# Altium project uz_d_iepe.PrjPCB (part 1 of 3)
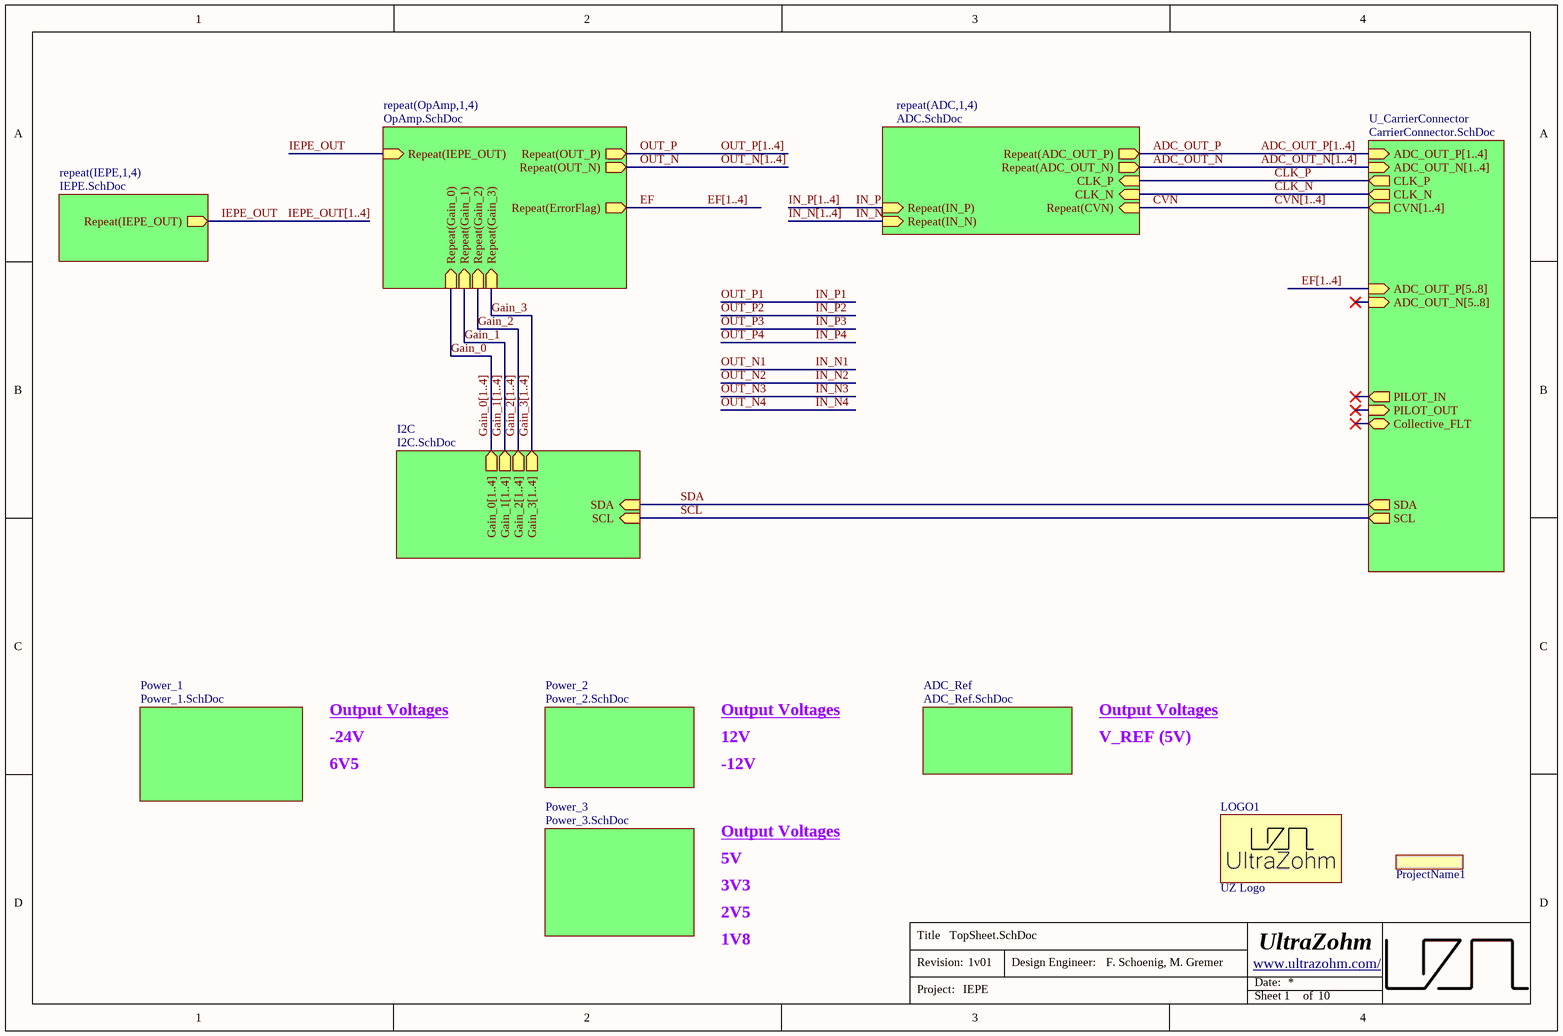
[diagram p0: TopSheet.SchDoc]
Author: F. Schoenig, M. Gremer; AuthorParam: F. Schoenig, M. Gremer; Date: 24.08.2021; ProjectName: IEPE; ProjectRevision: 1v01; SerialNr: 1; website: www.ultrazohm.com/
10 sheets, 404 parts. Net scope: hierarchical (ports join the sheet entries above them; power ports are global).
Board file: uz_d_iepe.PcbDoc
Sheets:
  TopSheet.SchDoc
    U_CarrierConnector = CarrierConnector.SchDoc
    OpAmp1 = OpAmp.SchDoc
    OpAmp2 = OpAmp.SchDoc
    OpAmp3 = OpAmp.SchDoc
    OpAmp4 = OpAmp.SchDoc
    ADC1 = ADC.SchDoc
    ADC2 = ADC.SchDoc
    ADC3 = ADC.SchDoc
    ADC4 = ADC.SchDoc
    Power_2 = Power_2.SchDoc
    Power_3 = Power_3.SchDoc
    ADC_Ref = ADC_Ref.SchDoc
    I2C = I2C.SchDoc
    Power_1 = Power_1.SchDoc
    IEPE1 = IEPE.SchDoc
    IEPE2 = IEPE.SchDoc
    IEPE3 = IEPE.SchDoc
    IEPE4 = IEPE.SchDoc

## Sheet TopSheet.SchDoc: UltraZohm IEPE
size A4; Author: Thomas Kreppel; CompanyName: TH Nürnberg; Organization: UltraZohm; Address1: Kesslerplatz 12; Address2: 90489 Nürnberg; Address3: GERMANY; Revision: 1v01; SheetNumber: 1; SheetTotal: 10; CompanyName2: Institut ELSYS

### Parts
LOGO1  UZ Logo  [UZ_Logo_tiny]  (no BOM)
ProjectName1  Project Name, Rev  [ID_ProjectRev]  (value not drawn)  (no BOM)

### Sub-sheets
ADC_Ref = ADC_Ref.SchDoc: no entries
I2C = I2C.SchDoc: SDA (in), SCL (in), Gain_1[1..4] (out), Gain_0[1..4] (out), Gain_3[1..4] (out), Gain_2[1..4] (out)
Power_1 = Power_1.SchDoc: no entries
Power_2 = Power_2.SchDoc: no entries
Power_3 = Power_3.SchDoc: no entries
repeat(ADC,1,4) = ADC.SchDoc: CLK_P (in), CLK_N (in), Repeat(ADC_OUT_N) (out), Repeat(ADC_OUT_P) (out), Repeat(CVN) (in), Repeat(IN_P) (in), Repeat(IN_N) (in)
repeat(IEPE,1,4) = IEPE.SchDoc: Repeat(IEPE_OUT) (out)
repeat(OpAmp,1,4) = OpAmp.SchDoc: Repeat(IEPE_OUT) (in), Repeat(OUT_P) (out), Repeat(OUT_N) (out), Repeat(Gain_1) (in), Repeat(Gain_3) (in), Repeat(Gain_0) (in), Repeat(Gain_2) (in), Repeat(ErrorFlag) (out)
U_CarrierConnector = CarrierConnector.SchDoc: PILOT_OUT (in), PILOT_IN (out), Collective_FLT (bidir), CLK_P (out), CLK_N (out), ADC_OUT_P[5..8] (in), ADC_OUT_N[5..8] (in), ADC_OUT_P[1..4] (in), ADC_OUT_N[1..4] (in), CVN[1..4] (out), SDA (out), SCL (out)

### Nets
ADC_OUT_N: sheet repeat(ADC,1,4)/Repeat(ADC_OUT_N)
ADC_OUT_P: sheet repeat(ADC,1,4)/Repeat(ADC_OUT_P)
CLK_N: sheet U_CarrierConnector/CLK_N, sheet repeat(ADC,1,4)/CLK_N
CLK_P: sheet U_CarrierConnector/CLK_P, sheet repeat(ADC,1,4)/CLK_P
CVN: sheet repeat(ADC,1,4)/Repeat(CVN)
EF: sheet repeat(OpAmp,1,4)/Repeat(ErrorFlag)
Gain_0: sheet repeat(OpAmp,1,4)/Repeat(Gain_0)
Gain_1: sheet repeat(OpAmp,1,4)/Repeat(Gain_1)
Gain_2: sheet repeat(OpAmp,1,4)/Repeat(Gain_2)
Gain_3: sheet repeat(OpAmp,1,4)/Repeat(Gain_3)
IEPE_OUT: sheet repeat(OpAmp,1,4)/Repeat(IEPE_OUT), sheet repeat(IEPE,1,4)/Repeat(IEPE_OUT)
IN_N: sheet repeat(ADC,1,4)/Repeat(IN_N)
IN_P: sheet repeat(ADC,1,4)/Repeat(IN_P)
OUT_N: sheet repeat(OpAmp,1,4)/Repeat(OUT_N)
OUT_P: sheet repeat(OpAmp,1,4)/Repeat(OUT_P)
SCL: sheet U_CarrierConnector/SCL, sheet I2C/SCL
SDA: sheet U_CarrierConnector/SDA, sheet I2C/SDA

### Buses and harness runs
bus ADC_OUT_N[1..4] = sheet U_CarrierConnector/ADC_OUT_N[1..4]
bus ADC_OUT_P[1..4] = sheet U_CarrierConnector/ADC_OUT_P[1..4]
bus CVN[1..4] = sheet U_CarrierConnector/CVN[1..4]
bus EF[1..4]
bus EF[1..4] = sheet U_CarrierConnector/ADC_OUT_P[5..8]
bus Gain_0[1..4] = sheet I2C/Gain_0[1..4]
bus Gain_1[1..4] = sheet I2C/Gain_1[1..4]
bus Gain_2[1..4] = sheet I2C/Gain_2[1..4]
bus Gain_3[1..4] = sheet I2C/Gain_3[1..4]
bus IEPE_OUT[1..4]
bus IN_N[1..4]
bus IN_P[1..4]
bus OUT_N[1..4]
bus OUT_P[1..4]

### Notes on the sheet
- Output Voltages
- 6V5
- -24V
- 12V
- -12V
- V_REF (5V)
- 5V
- 2V5
- 3V3
- 1V8
- Title
- Revision:
- Design Engineer:
- Date:
- Project:
- Sheet
- of

### Library data of the parts
LOGO1 = UZ Logo: UltraZohm Logo on PCB; Created: Jan2021_Liegmann; Value: UZ Logo
ProjectName1 = ID_ProjectRev: Project Name and Revision Number; Created: 2018_11_23_AGeiger; Value: Project Name, Rev

## Sheet CarrierConnector.SchDoc
size A4; CompanyName: TH Nürnberg; Organization: UltraZohm; Address1: Kesslerplatz 12; Address2: 90489 Nürnberg; Address3: GERMANY; Revision: 1v01; SheetNumber: 2; SheetTotal: 10; CompanyName2: Institut ELSYS
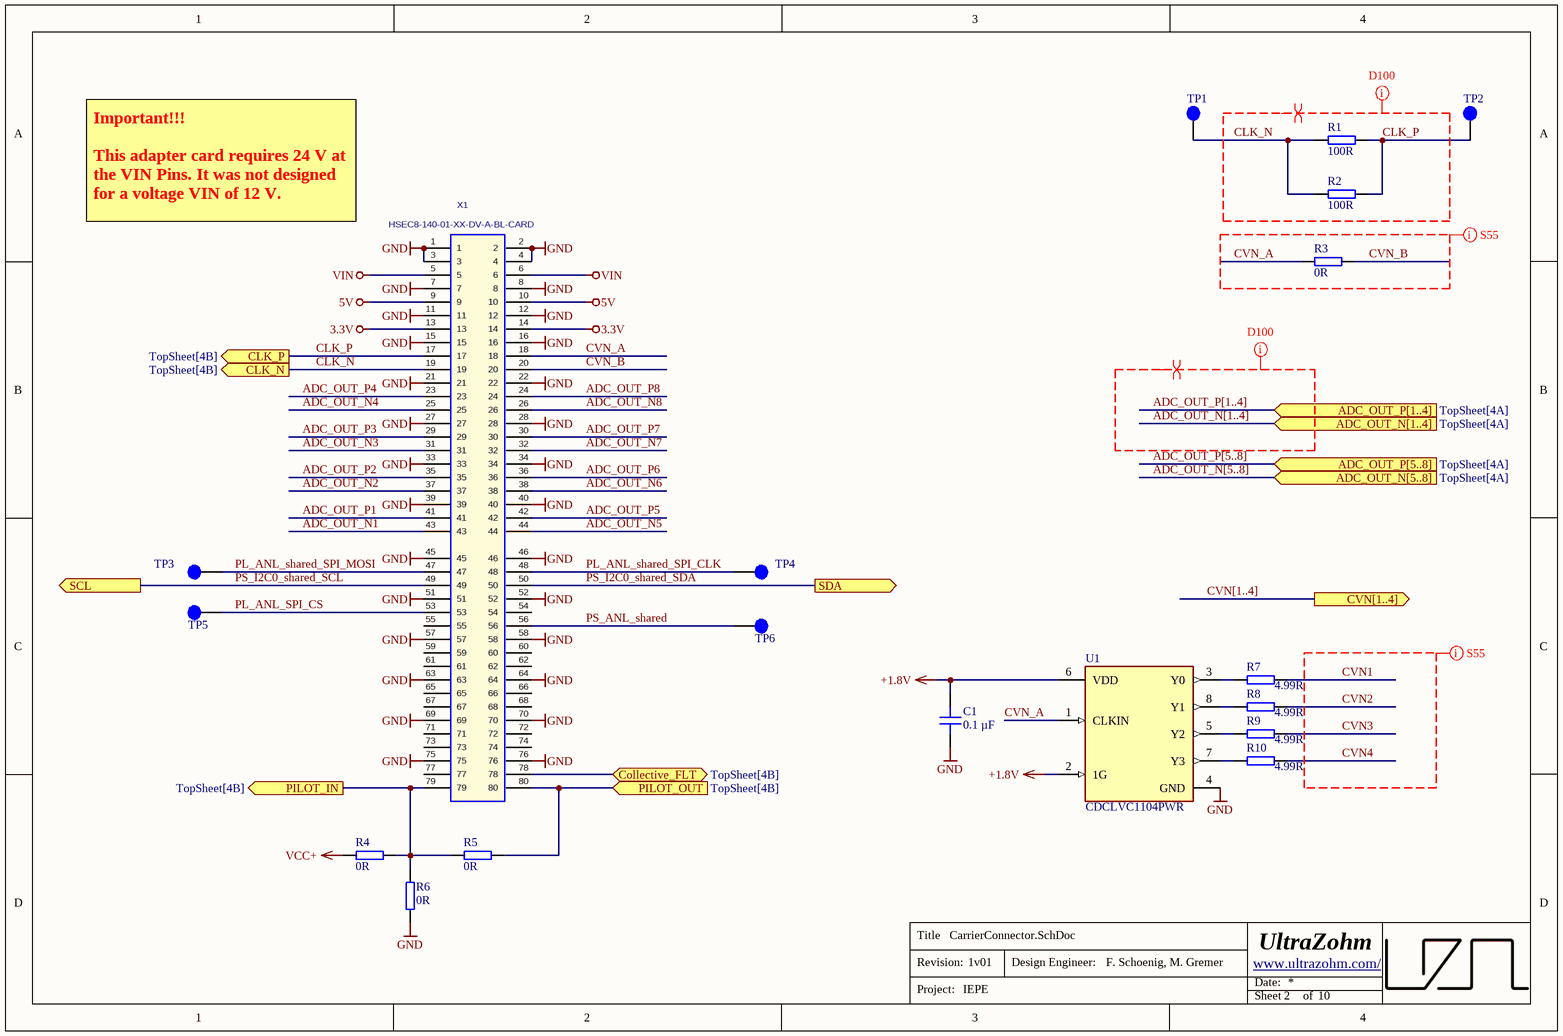
[diagram p1: CarrierConnector.SchDoc]

### Parts
C1  0.1 µF  [C_0603]
R1  100R  [RES 0603_1608]
R2  100R  [RES 0603_1608]
R3  0R  [RES 0603_1608]
R4  0R  [RES 0603_1608]
R5  0R  [RES 0603_1608]
R6  0R  [RES 0603_1608]
R7  4.99R  [RES 0603_1608]
R8  4.99R  [RES 0603_1608]
R9  4.99R  [RES 0603_1608]
R10  4.99R  [RES 0603_1608]
TP1  -  [TP_1mm]  (value not drawn)
TP2  -  [TP_1mm]  (value not drawn)
TP3  -  [TP_1mm]  (value not drawn)
TP4  -  [TP_1mm]  (value not drawn)
TP5  -  [TP_1mm]  (value not drawn)
TP6  -  [TP_1mm]  (value not drawn)
U1  CDCLVC1104PWR  [FP-PW0008A-MFG]
X1  HSEC8-140-01-XX-DV-A-BL-CARD  [HSEC8-140-01-XX-DV-A-BL-CARD]  (no BOM)

### Ports
ADC_OUT_N[1..4] (in, see TopSheet[4A]), ADC_OUT_N[5..8] (in, see TopSheet[4A]), ADC_OUT_P[1..4] (in, see TopSheet[4A]), ADC_OUT_P[5..8] (in, see TopSheet[4A]), CLK_N (out, see TopSheet[4B]), CLK_P (out, see TopSheet[4B]), Collective_FLT (bidir, see TopSheet[4B]), CVN[1..4] (out), PILOT_IN (out, see TopSheet[4B]), PILOT_OUT (in, see TopSheet[4B]), SCL (out), SDA (out)

### Nets
3.3V: X1.13 X1.14
5V: X1.9 X1.10
+1.8V: C1.2 U1.2(1G) U1.6(VDD)
GND: C1.1 R6.1 U1.4(GND) X1.1 X1.2 X1.3 X1.4 X1.7 X1.8 X1.11 X1.12 X1.15 X1.16 X1.21 X1.22 X1.27 X1.28 X1.33 X1.34 X1.39 X1.40 X1.45 X1.46 X1.51 X1.52 X1.57 X1.58 X1.63 X1.64 X1.69 X1.70 X1.75 X1.76
VCC+: R4.1
VIN: X1.5 X1.6
ADC_OUT_N1: X1.43
ADC_OUT_N2: X1.37
ADC_OUT_N3: X1.31
ADC_OUT_N4: X1.25
ADC_OUT_N5: X1.44
ADC_OUT_N6: X1.38
ADC_OUT_N7: X1.32
ADC_OUT_N8: X1.26
ADC_OUT_P1: X1.41
ADC_OUT_P2: X1.35
ADC_OUT_P3: X1.29
ADC_OUT_P4: X1.23
ADC_OUT_P5: X1.42  [project net EF1]
ADC_OUT_P6: X1.36  [project net EF2]
ADC_OUT_P7: X1.30  [project net EF3]
ADC_OUT_P8: X1.24  [project net EF4]
CLK_N: R1.1 R2.1 TP1.1 X1.19 ; port CLK_N
CLK_P: R1.2 R2.2 TP2.1 X1.17 ; port CLK_P
CVN1: R7.2
CVN2: R8.2
CVN3: R9.2
CVN4: R10.2
CVN_A: R3.1 U1.1(CLKIN) X1.18
CVN_B: R3.2 X1.20
PL_ANL_shared_SPI_CLK: TP4.1 X1.48
PL_ANL_shared_SPI_MOSI: TP3.1 X1.47
PL_ANL_SPI_CS: TP5.1 X1.53
PS_ANL_shared: TP6.1 X1.56
PS_I2C0_shared_SCL: X1.49 ; port SCL  [project net SCL]
PS_I2C0_shared_SDA: X1.50 ; port SDA  [project net SDA]
NetR4_2: R4.2 R5.1 R6.2 X1.79 ; port PILOT_IN
NetR5_2: R5.2 X1.80 ; port PILOT_OUT
NetR7_1: R7.1 U1.3(Y0)
NetR8_1: R8.1 U1.8(Y1)
NetR9_1: R9.1 U1.5(Y2)
NetR10_1: R10.1 U1.7(Y3)
NetX1_78: X1.78 ; port Collective_FLT

Not connected (* = marked no-connect by the designer): X1 54 55 59 60 61 62 65 66 67 68 71 72 73 74 77

### Buses and harness runs
bus ADC_OUT_N[1..4] = port ADC_OUT_N[1..4]
bus ADC_OUT_N[5..8] = port ADC_OUT_N[5..8]
bus ADC_OUT_P[1..4] = port ADC_OUT_P[1..4]
bus ADC_OUT_P[5..8] = port ADC_OUT_P[5..8]
bus CVN[1..4] = port CVN[1..4]

### Layout directives
net class S55: CVN1, CVN2, CVN3, CVN4, CVN_A, CVN_B
differential pair: ADC_OUT_N[1..4], ADC_OUT_P[1..4], CLK_N, CLK_P
net class D100: ADC_OUT_N[1..4], ADC_OUT_P[1..4], CLK_N, CLK_P

### Notes on the sheet
- Important!!!
  This adapter card requires 24 V at the VIN Pins. It was not designed for a voltage VIN of 12 V.
- Title
- Revision:
- Design Engineer:
- Date:
- Project:
- Sheet
- of

### Library data of the parts
C1 = C0603X104K5RAC7411: Capacitor 0603, 50 VDC, 0.1 µF, X7R; Manufacturer: KEMET; Tolerance: 10 %; Voltage Rating: 50 VDC; Created from: MGremer; Manufacturer Part Number: C0603X104K5RAC7411; PartID: 3; Created On: 20.12.2020 13:54:13; ComponentLink1Description: Datasheet; ComponentLink1URL: https://www.mouser.de/datasheet/2/212/1/KEM_C1013_X7R_FT_CAP_SMD-1103280.pdf; Component Type: Capacitor 0603; Device Package: 0603; Last Updated: 04.03.2021 09:24:28; Mounting Type: SMD; Operating Temperature: -55 - 125°C; Series: SMD Comm X7R Flex; Supplier 1: Mouser; Supplier Part Number 1: 80-C0603X104K5R7411; Supplier 2: LCSC; Supplier Part Number 2: C14663; Type: Capacitor; Value: 0.1 µF; Live Cycle Status: 1; LCSC Part Number: C14663; Stock number: Labor SMD Container
R1 R2 = RK73B1JTTD101J: SMD resistor E24 series; Manufacturer: KOA Speer; Tolerance: 5%; Created from: MGremer; Manufacturer Part Number: RK73B1JTTD101J; PartID: 50; Created On: 14.12.2020 16:17:14; ComponentLink1Description: Datasheet; ComponentLink1URL: https://www.mouser.de/datasheet/2/219/RK73B-1825463.pdf; Component Type: SMD resistor; Device Package: 0603; Last Updated: 02.03.2021 14:07:32; Mounting Type: SMD; Supplier 1: Mouser; Supplier Part Number 1: 660-RK73B1JTTD101J; Type: Resistor; Value: 100R; Live Cycle Status: 1; Stock number: Labor SMD Container
R3-R6 = RC0603JR-070RL: SMD resistor E24 series; Manufacturer: YAGEO; Tolerance: 5%; Created from: MGremer; Manufacturer Part Number: RC0603JR-070RL; PartID: 1; Created On: 14.12.2020 16:17:14; ComponentLink1Description: Datasheet; ComponentLink1URL: https://www.mouser.de/datasheet/2/447/PYu-RC_Group_51_RoHS_L_10-1664068.pdf; Component Type: SMD resistor; Device Package: 0603; Last Updated: 04.03.2021 09:09:42; Mounting Type: SMD; Supplier 1: Mouser; Supplier Part Number 1: 603-RC0603JR-070RL; Supplier 2: LCSC; Supplier Part Number 2: C21189; Type: Resistor; Value: 0R; Live Cycle Status: 1; Stock number: Labor SMD Container; LCSC Part Number: C21189
R7-R10 = CRCW06034R99FKEA: SMD resistor 1%; Manufacturer: Vishay / Dale; Created from: MGremer; Manufacturer Part Number: CRCW06034R99FKEA; PartID: 178; Created On: 14.12.2020 16:17:14; ComponentLink1Description: Datasheet; ComponentLink1URL: https://www.mouser.de/datasheet/2/427/dcrcwe3-1762152.pdf; Component Type: SMD resistor; Device Package: 0603; Last Updated: 02.03.2021 14:07:32; Mounting Type: SMD; Supplier 1: Mouser; Supplier Part Number 1: 71-CRCW0603-4.99-E3; Type: Resistor; Tolerance: 1%; Value: 4.99R; Live Cycle Status: 1; Stock number: not stored
TP1-TP6 = -: Test Point 1 mm; Value: TP; Created from: MGremer; Created: 2018_06_25_AGeiger; Manufacturer Part Number: -; PartID: 9; Created On: 02.03.2021 14:59:37; ComponentLink1Description: Datasheet; ComponentLink1URL: -; ComponentLink2Description: Homepage; ComponentLink2URL: -; Component Type: Test Point; Device Package: SMD; Last Updated: 08.10.2021 21:16:06; Manufacturer: -; Minimum Order: 1; Mounting Type: SMD; Supplier 1: -; Supplier Part Number 1: -; Type: Test point; Live Cycle Status: 1; Stock number: not stored
U1 = CDCLVC1104PWR: High Performance Clock Puffer, 1:4 LVCMOS Fan-out; Manufacturer: Texas Instruments; Created from: MGremer; Manufacturer Part Number: CDCLVC1104PWR; PartID: 5; Created On: 04.02.2021 10:13:41; ComponentLink1Description: Datasheet; ComponentLink1URL: https://www.ti.com/general/docs/suppproductinfo.tsp?distId=26&gotoUrl=http%253A%252F%252Fwww.ti.com%252Flit%252Fgpn%252Fcdclvc1104; Component Type: High Performance Clock Puffer; Device Package: TSSOP-8; Last Updated: 04.02.2021 10:13:41; Mounting Type: SMD; Operating Temperature: -40 - 85 °C; Series: CDCLVC1104; Supplier 1: Mouser; Supplier Part Number 1: 595-CDCLVC1104PWR; Type: Clock Puffer; Value: 1:4; Live Cycle Status: 1; Stock number: not stored
X1 = HSEC8-140-01-XX-DV-A-BL-CARD: Mating Card Layout for HSEC8-140-01-XX-DV-A-BL; Manufacturer: SAMTEC; Created: 2018_04_23_AGeiger; Value: HSEC8-140-01-XX-DV-A-BL-CARD; ComponentLink1Description: Info; ComponentLink1URL: https://www.samtec.com/de/products/hsec8-140-01-l-dv-a-bl-k-tr

## Sheet OpAmp.SchDoc
size A4; CompanyName: TH Nürnberg; Organization: UltraZohm; Address1: Kesslerplatz 12; Address2: 90489 Nürnberg; Address3: GERMANY; SheetNumber: 4; SheetTotal: 10
Used 4 times, as channels OpAmp1, OpAmp2, OpAmp3, OpAmp4. Parts and nets are listed once, with the designators drawn on the sheet.
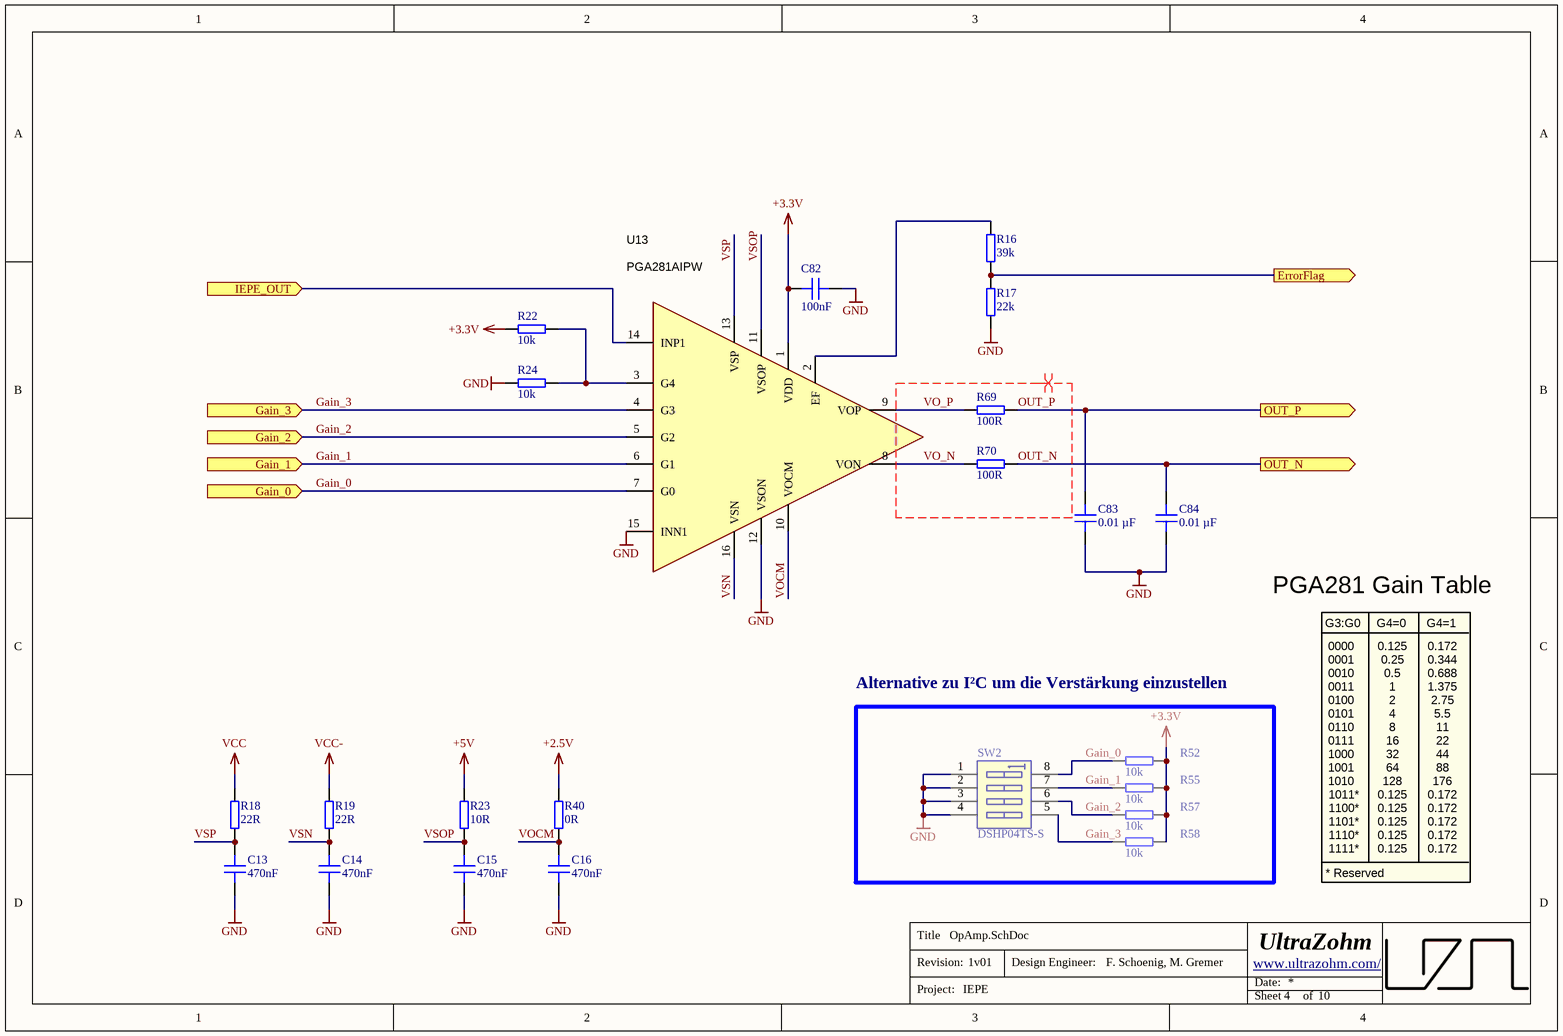
[diagram p2: OpAmp.SchDoc]

### Parts
C13  470nF  [C_0603]
C14  470nF  [C_0603]
C15  470nF  [C_0603]
C16  470nF  [C_0603]
C82  100nF  [C_0603]
C83  0.01 µF  [C_0603]
C84  0.01 µF  [C_0603]
R16  39k  [RES 0603_1608]
R17  22k  [RES 0603_1608]
R18  22R  [RES 0603_1608]
R19  22R  [RES 0603_1608]
R22  10k  [RES 0603_1608]
R23  10R  [RES 0603_1608]
R24  10k  [RES 0603_1608]
R40  0R  [RES 0603_1608]
R52  10k  [RES 0603_1608]
R55  10k  [RES 0603_1608]
R57  10k  [RES 0603_1608]
R58  10k  [RES 0603_1608]
R69  100R  [RES 0603_1608]
R70  100R  [RES 0603_1608]
SW2  DSHP04TS-S  [416131160804]
U13  PGA281AIPW  [PW0016A_N]

### Blocks framed on the sheet
Alternative zu I²C um die Verstärkung einzustellen: R52 R55 R57 R58 SW2

### Ports
ErrorFlag (out), Gain_0 (in), Gain_1 (in), Gain_2 (in), Gain_3 (in), IEPE_OUT (in), OUT_N (out), OUT_P (out)

### Nets
+2.5V: R40.2
+3.3V: C82.2 R22.1 R52.1 R55.1 R57.1 R58.1 U13.1(VDD)
+5V: R23.2
GND: C13.1 C14.1 C15.1 C16.1 C82.1 C83.1 C84.1 R17.1 R24.1 SW2.1 SW2.2 SW2.3 SW2.4 U13.12(VSON) U13.15(INN1)
VCC: R18.2
VCC-: R19.2
ErrorFlag: R16.1 R17.2 ; port ErrorFlag
Gain_0: R52.2 SW2.8 U13.7(G0) ; port Gain_0
Gain_1: R55.2 SW2.7 U13.6(G1) ; port Gain_1
Gain_2: R57.2 SW2.6 U13.5(G2) ; port Gain_2
Gain_3: R58.2 SW2.5 U13.4(G3) ; port Gain_3
IEPE_OUT: U13.14(INP1) ; port IEPE_OUT
OUT_N: C84.2 R70.2 ; port OUT_N
OUT_P: C83.2 R69.2 ; port OUT_P
VO_N: R70.1 U13.8(VON)
VO_P: R69.1 U13.9(VOP)
VOCM: C16.2 R40.1 U13.10(VOCM)
VSN: C14.2 R19.1 U13.16(VSN)
VSOP: C15.2 R23.1 U13.11(VSOP)
VSP: C13.2 R18.1 U13.13(VSP)
NetR16_2: R16.2 U13.2(EF)
NetR22_2: R22.2 R24.2 U13.3(G4)

### Channels
OpAmp1: designators end in A; ports ErrorFlag=EF1 Gain_0=Gain_01 Gain_1=Gain_11 Gain_2=Gain_21 Gain_3=Gain_31 IEPE_OUT=IEPE_OUT1 OUT_N=IN_N1 OUT_P=IN_P1
OpAmp2: designators end in B; ports ErrorFlag=EF2 Gain_0=Gain_02 Gain_1=Gain_12 Gain_2=Gain_22 Gain_3=Gain_32 IEPE_OUT=IEPE_OUT2 OUT_N=IN_N2 OUT_P=IN_P2
OpAmp3: designators end in C; ports ErrorFlag=EF3 Gain_0=Gain_03 Gain_1=Gain_13 Gain_2=Gain_23 Gain_3=Gain_33 IEPE_OUT=IEPE_OUT3 OUT_N=IN_N3 OUT_P=IN_P3
OpAmp4: designators end in D; ports ErrorFlag=EF4 Gain_0=Gain_04 Gain_1=Gain_14 Gain_2=Gain_24 Gain_3=Gain_34 IEPE_OUT=IEPE_OUT4 OUT_N=IN_N4 OUT_P=IN_P4

### Layout directives
differential pair: OUT_N, OUT_P, VO_N, VO_P

### Notes on the sheet
- PGA281 Gain Table
- 0000
- 0001
- G3:G0
- G4=0
- 0.125
- 0.25
- G4=1
- 0.172
- 0.344
- 0010
- 0011
- 0100
- 0101
- 0.5
- 1
- 2
- 4
- 0.688
- 1.375
- 2.75
- 5.5
- 0110
- 0111
- 1000
- 1001
- 1010
- 1011*
- 8
- 16
- 32
- 64
- 128
- 11
- 22
- 44
- 88
- 176
- 1100*
- 1101*
- 1110*
- 1111*
- * Reserved
- Title
- Revision:
- Design Engineer:
- Date:
- Project:
- Sheet
- of

### Library data of the parts
C13-C16 C82 = C0603C104J3REC7411: Capacitor 0603, 25 VDC, 0.1 µF, X7R; Manufacturer Part Number: C0603C104J3REC7411
C83 C84 = GCJ188R71H103KA01D: Capacitor 0603, 50 VDC, 0.01 µF, X7R; Manufacturer: muRata; Tolerance: 10 %; Voltage Rating: 50 VDC; Created from: MGremer; Manufacturer Part Number: GCJ188R71H103KA01D; PartID: 1; Created On: 20.12.2020 13:54:13; ComponentLink1Description: Datasheet; ComponentLink1URL: https://www.mouser.de/datasheet/2/281/c03e-516224.pdf; Component Type: Capacitor 0603; Device Package: 0603; Last Updated: 20.12.2020 16:24:16; Mounting Type: SMD; Operating Temperature: -55 - 125°C; Series: GCJ; Supplier 1: Mouser; Supplier Part Number 1: 81-GCJ188R71H103KA1D; Type: Capacitor; Value: 0.01 µF; Live Cycle Status: 1; Stock number: Labor SMD Container
R16 = RK73B1JTTDD393J: SMD resistor E24 series; Manufacturer: KOA Speer; Tolerance: 5%; Created from: MGremer; Manufacturer Part Number: RK73B1JTTDD393J; PartID: 112; Created On: 14.12.2020 16:17:14; ComponentLink1Description: Datasheet; ComponentLink1URL: https://www.mouser.de/datasheet/2/219/RK73B-1825463.pdf; Component Type: SMD resistor; Device Package: 0603; Last Updated: 02.03.2021 14:07:32; Mounting Type: SMD; Supplier 1: Mouser; Supplier Part Number 1: 660-RK73B1JTTDD393J; Type: Resistor; Value: 39k; Live Cycle Status: 1; Stock number: Labor SMD Container
R17 = RK73B1JTTD223J: SMD resistor E24 series; Manufacturer: KOA Speer; Tolerance: 5%; Created from: MGremer; Manufacturer Part Number: RK73B1JTTD223J; PartID: 106; Created On: 14.12.2020 16:17:14; ComponentLink1Description: Datasheet; ComponentLink1URL: https://www.mouser.de/datasheet/2/219/RK73B-1825463.pdf; Component Type: SMD resistor; Device Package: 0603; Last Updated: 02.03.2021 14:07:32; Mounting Type: SMD; Supplier 1: Mouser; Supplier Part Number 1: 660-RK73B1JTTD223J; Type: Resistor; Value: 22k; Live Cycle Status: 1; Stock number: Labor SMD Container
R18 R19 R23 = RC0603JR-070RL: SMD resistor E24 series; Manufacturer Part Number: RC0603JR-070RL
R22 R24 R52 R55 R57 R58 = RK73B1JTTD103J: SMD resistor E24 series; Manufacturer: KOA Speer; Tolerance: 5%; Created from: MGremer; Manufacturer Part Number: RK73B1JTTD103J; PartID: 98; Created On: 14.12.2020 16:17:14; ComponentLink1Description: Datasheet; ComponentLink1URL: https://www.mouser.de/datasheet/2/219/RK73B-1825463.pdf; Component Type: SMD resistor; Device Package: 0603; Last Updated: 02.03.2021 14:07:32; Mounting Type: SMD; Supplier 1: Mouser; Supplier Part Number 1: 660-RK73B1JTTD103J; Type: Resistor; Value: 10k; Live Cycle Status: 1; Stock number: Labor SMD Container
R40 = RC0603JR-070RL: as R3 on sheet CarrierConnector; Manufacturer Part Number: RC0603JR-070RL; PartID: 1; Created On: 14.12.2020 16:17:14; ComponentLink1Description: Datasheet; ComponentLink1URL: https://www.mouser.de/datasheet/2/447/PYu-RC_Group_51_RoHS_L_10-1664068.pdf; Component Type: SMD resistor; Device Package: 0603; Last Updated: 04.03.2021 09:09:42; Mounting Type: SMD; Supplier 1: Mouser; Supplier Part Number 1: 603-RC0603JR-070RL; Supplier 2: LCSC; Supplier Part Number 2: C21189; Type: Resistor; Value: 0R; Live Cycle Status: 1; Stock number: Labor SMD Container; LCSC Part Number: C21189
R69 R70 = RK73B1JTTD101J: as R1 on sheet CarrierConnector; Manufacturer Part Number: RK73B1JTTD101J; PartID: 50; Created On: 14.12.2020 16:17:14; ComponentLink1Description: Datasheet; ComponentLink1URL: https://www.mouser.de/datasheet/2/219/RK73B-1825463.pdf; Component Type: SMD resistor; Device Package: 0603; Last Updated: 02.03.2021 14:07:32; Mounting Type: SMD; Supplier 1: Mouser; Supplier Part Number 1: 660-RK73B1JTTD101J; Type: Resistor; Value: 100R; Live Cycle Status: 1; Stock number: Labor SMD Container
SW2 = DSHP04TS-S: 04p, 1.27mm Pitch, Horizontal, HP Type, SMT, flat Actuator, black, with Tape, T&R; Manufacturer: XKB Connectivity; Created from: T. Wendt; Manufacturer Part Number: DSHP04TS-S; PartID: 6; Created On: 02.03.2021 14:59:37; ComponentLink1Description: Datasheet; ComponentLink1URL: https://datasheet.lcsc.com/szlcsc/1912111437_XKB-Connectivity-DSHP04TS-S_C319050.pdf; Component Type: DIP-Switch; Device Package: DIP; Last Updated: 02.03.2021 14:59:37; Minimum Order: 1; Mounting Type: SMD; Supplier 1: LCSC; Supplier Part Number 1: C319050; Type: DIP-Switch; Live Cycle Status: 1; LCSC Part Number: C319050; Stock number: not stored
U13 = PGA281AIPW: Precision,Zero-Drift,High-Voltage,Programmable Gain Instrumentation Amplifier; Manufacturer: Texas Instruments; PartNumber: Used in BOM report; SymbolVersion: use current date i.e. 2008-05-20; SymbolCreator: Use a-id; CompType: Used in some BOM reports.  Useful for finding later.; U/M: EA, IN, or GM; Created from: PTurowski; MountType: SMT, TH, or N/A; RoHS: Used in BOM report.  Use Y or N.; PackageReference: eg:  0603, used in PnP report; ComponentLink1Description: Datasheet; ComponentLink1URL: https://www.ti.com/lit/ds/symlink/pga281.pdf?HQS=dis-mous-null-mousermode-dsf-pf-null-wwe&ts=1621241302298; Alternate PartNumber: -; Alternate Manufacturer: -; Manufacturer Part Number: PGA281AIPW; PartID: 6; Created On: 25.05.2021 11:50:21; Component Type: Operational Amplifier; Last Updated: 23.08.2021 10:37:27; Mounting Type: SMD/SMT; Operating Temperature: -40 - 125°C; Supplier 1: Mouser; Supplier Part Number 1: 595-PGA281AIPW; Type: OPAMP; Live Cycle Status: 1; Stock number: not stored

## Sheet ADC.SchDoc
size A4; CompanyName: TH Nürnberg; Organization: UltraZohm; Address1: Kesslerplatz 12; Address2: 90489 Nürnberg; Address3: GERMANY; SheetNumber: 5; SheetTotal: 10
Used 4 times, as channels ADC1, ADC2, ADC3, ADC4. Parts and nets are listed once, with the designators drawn on the sheet.
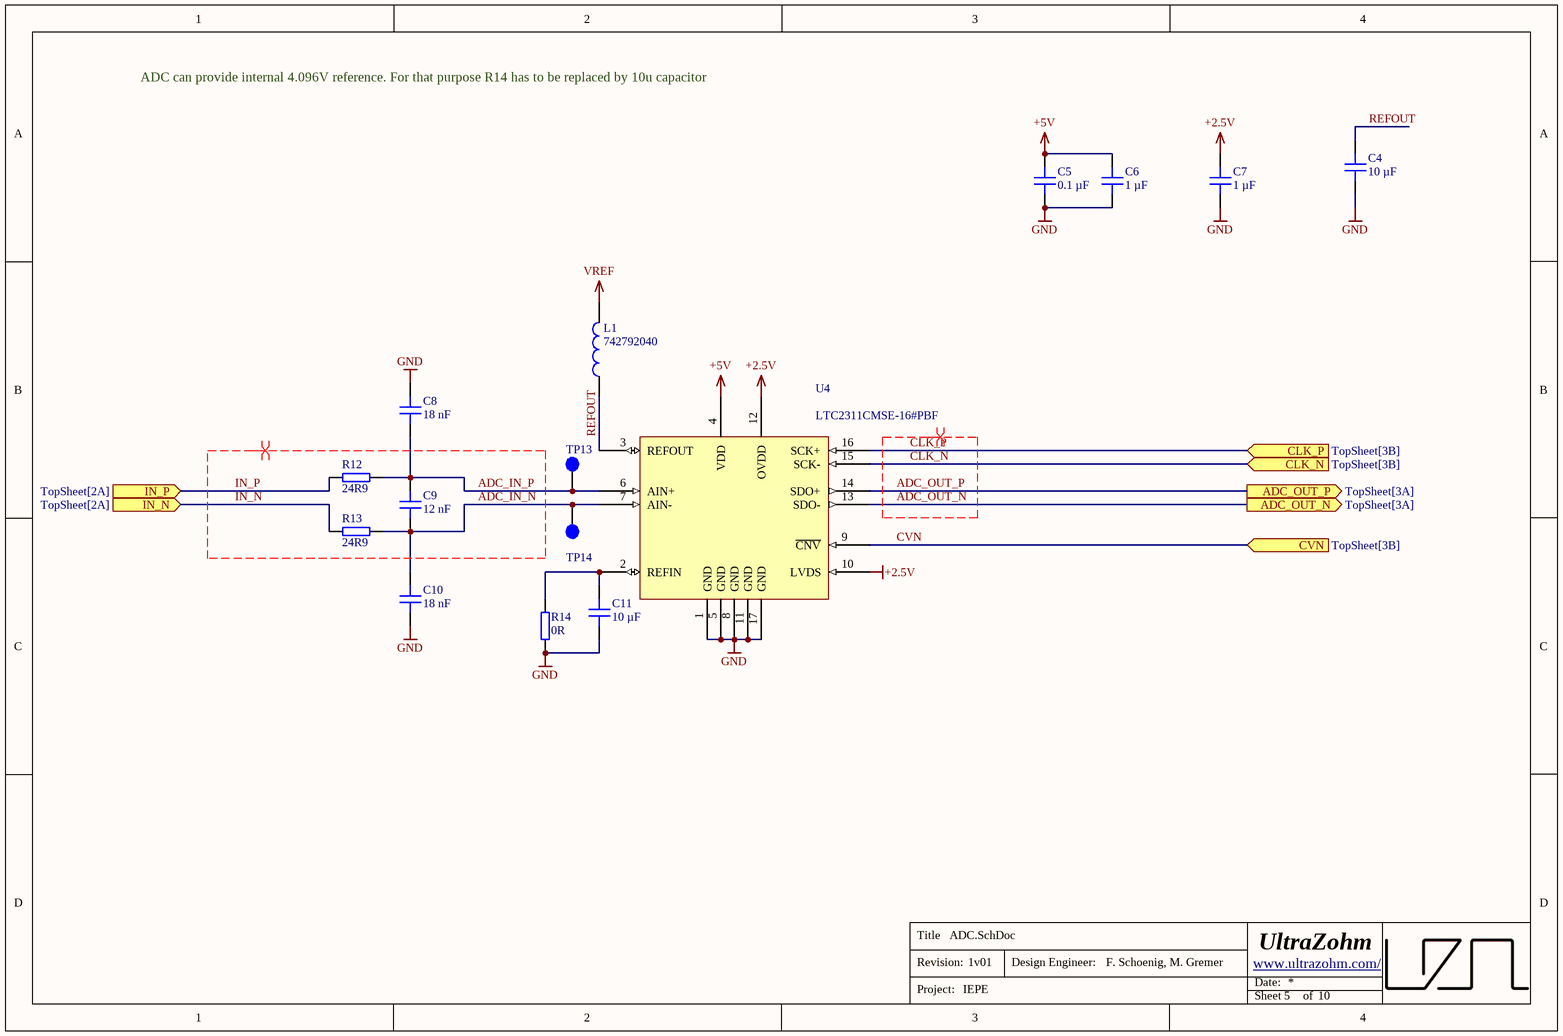
[diagram p3: ADC.SchDoc]

### Parts
C4  10 µF  [C_0805]
C5  0.1 µF  [C_0603]
C6  1 µF  [C_0603]
C7  1 µF  [C_0603]
C8  18 nF  [C_0603]
C9  12 nF  [C_0603]
C10  18 nF  [C_0603]
C11  10 µF  [C_0805]
L1  742792040  [WE-CBF_0805_High Current]
R12  24R9  [RES 0603_1608]
R13  24R9  [RES 0603_1608]
R14  0R  [RES 0603_1608]
TP13  -  [TP_1mm]  (value not drawn)
TP14  -  [TP_1mm]  (value not drawn)
U4  LTC2311CMSE-16#PBF  [TSSOP50P510X110_HS-17N]

### Ports
ADC_OUT_N (out, see TopSheet[3A]), ADC_OUT_P (out, see TopSheet[3A]), CLK_N (in, see TopSheet[3B]), CLK_P (in, see TopSheet[3B]), CVN (in, see TopSheet[3B]), IN_N (in, see TopSheet[2A]), IN_P (in, see TopSheet[2A])

### Nets
+2.5V: C7.2 U4.10(LVDS) U4.12(OVDD)
+5V: C5.2 C6.2 U4.4(VDD)
GND: C4.1 C5.1 C6.1 C7.1 C8.2 C10.1 C11.1 R14.1 U4.1(GND) U4.5(GND) U4.8(GND) U4.11(GND) U4.17(GND)
VREF: L1.2
ADC_IN_N: C9.1 C10.2 R13.2 TP14.1 U4.7(AIN-)
ADC_IN_P: C8.1 C9.2 R12.2 TP13.1 U4.6(AIN+)
ADC_OUT_N: U4.13(SDO-) ; port ADC_OUT_N
ADC_OUT_P: U4.14(SDO+) ; port ADC_OUT_P
CLK_N: U4.15(SCK-) ; port CLK_N
CLK_P: U4.16(SCK+) ; port CLK_P
CVN: U4.9(~{CNV}) ; port CVN
IN_N: R13.1 ; port IN_N
IN_P: R12.1 ; port IN_P
REFOUT: C4.2 L1.1 U4.3(REFOUT)
NetC11_2: C11.2 R14.2 U4.2(REFIN)

### Channels
ADC1: designators end in A; ports ADC_OUT_N=ADC_OUT_N1 ADC_OUT_P=ADC_OUT_P1 CLK_N=CLK_N CLK_P=CLK_P CVN=CVN1 IN_N=IN_N1 IN_P=IN_P1
ADC2: designators end in B; ports ADC_OUT_N=ADC_OUT_N2 ADC_OUT_P=ADC_OUT_P2 CLK_N=CLK_N CLK_P=CLK_P CVN=CVN2 IN_N=IN_N2 IN_P=IN_P2
ADC3: designators end in C; ports ADC_OUT_N=ADC_OUT_N3 ADC_OUT_P=ADC_OUT_P3 CLK_N=CLK_N CLK_P=CLK_P CVN=CVN3 IN_N=IN_N3 IN_P=IN_P3
ADC4: designators end in D; ports ADC_OUT_N=ADC_OUT_N4 ADC_OUT_P=ADC_OUT_P4 CLK_N=CLK_N CLK_P=CLK_P CVN=CVN4 IN_N=IN_N4 IN_P=IN_P4

### Layout directives
differential pair: ADC_IN_N, ADC_IN_P, ADC_OUT_N, ADC_OUT_P, CLK_N, CLK_P, IN_N, IN_P

### Notes on the sheet
- ADC can provide internal 4.096V reference. For that purpose R14 has to be replaced by 10u capacitor
- Title
- Revision:
- Design Engineer:
- Date:
- Project:
- Sheet
- of

### Library data of the parts
C4 C11 = GRM219R61E106KA12D: Capacitor 0805, 25 VDC, 10 µF, X5R; Manufacturer: muRata; Tolerance: 10 %; Voltage Rating: 25 VDC; Created from: MGremer; Manufacturer Part Number: GRM219R61E106KA12D; PartID: 13; Created On: 20.12.2020 13:54:13; ComponentLink1Description: Datasheet; ComponentLink1URL: https://www.mouser.de/datasheet/2/281/murata_03052018_GRM_Series_1-1310166.pdf; Component Type: Capacitor 0805; Device Package: 0805; Last Updated: 20.12.2020 16:34:30; Mounting Type: SMD; Operating Temperature: -55 - 85°C; Series: GRM; Supplier 1: Mouser; Supplier Part Number 1: 81-GRM219R61E106KA2D; Type: Capacitor; Value: 10 µF; Live Cycle Status: 1; Stock number: Labor SMD Container
C5 = C0603X104K5RAC7411: as C1 on sheet CarrierConnector; Manufacturer Part Number: C0603X104K5RAC7411; PartID: 3; Created On: 20.12.2020 13:54:13; ComponentLink1Description: Datasheet; ComponentLink1URL: https://www.mouser.de/datasheet/2/212/1/KEM_C1013_X7R_FT_CAP_SMD-1103280.pdf; Component Type: Capacitor 0603; Device Package: 0603; Last Updated: 04.03.2021 09:24:28; Mounting Type: SMD; Operating Temperature: -55 - 125°C; Series: SMD Comm X7R Flex; Supplier 1: Mouser; Supplier Part Number 1: 80-C0603X104K5R7411; Supplier 2: LCSC; Supplier Part Number 2: C14663; Type: Capacitor; Value: 0.1 µF; Live Cycle Status: 1; LCSC Part Number: C14663; Stock number: Labor SMD Container
C6 C7 = JMK107BJ105MA-T: Capacitor 0603, 6.3 VDC, 1 µF, X7R; Manufacturer: Tajyo Yuden; Tolerance: 20 %; Voltage Rating: 6.3 VDC; Created from: MGremer; Manufacturer Part Number: JMK107BJ105MA-T; PartID: 48; Created On: 20.12.2020 13:54:13; ComponentLink1Description: Datasheet; ComponentLink1URL: https://www.mouser.de/datasheet/2/396/mlcc02_e-1307760.pdf; Component Type: Capacitor 0603; Device Package: 0603; Last Updated: 20.12.2020 16:43:29; Mounting Type: SMD; Operating Temperature: -55 - 85°C; Series: CC; Supplier 1: Mouser; Supplier Part Number 1: 963-JMK107BJ105MA-T; Type: Capacitor; Value: 1 µF; Live Cycle Status: 1; Stock number: not stored
C8 C10 = C0603C183K4RACTU: Capacitor 0603, 16 VDC, 18 nF, X7R; Manufacturer: KEMET; Tolerance: 10 %; Voltage Rating: 16 VDC; Created from: MGremer; Manufacturer Part Number: C0603C183K4RACTU; PartID: 46; Created On: 20.12.2020 13:54:13; ComponentLink1Description: Datasheet; ComponentLink1URL: https://www.mouser.de/datasheet/2/212/KEM_C1002_X7R_SMD-1102033.pdf; Component Type: Capacitor 0603; Device Package: 0603; Last Updated: 08.10.2021 08:30:37; Mounting Type: SMD; Operating Temperature: -55 - 125°C; Series: SMD Comm X7R; Supplier 1: Mouser; Supplier Part Number 1: 80-C0603C183K4R; Type: Capacitor; Value: 18 nF; Live Cycle Status: 1; Stock number: not stored
C9 = CC0603KRX7R7BB123: Capacitor 0603, 16 VDC, 12 nF, X7R; Manufacturer: Yageo; Tolerance: 10 %; Voltage Rating: 16 VDC; Created from: MGremer; Manufacturer Part Number: CC0603KRX7R7BB123; PartID: 47; Created On: 20.12.2020 13:54:13; ComponentLink1Description: Datasheet; ComponentLink1URL: https://www.mouser.de/datasheet/2/447/UPY-GPHC_X7R_6.3V-to-50V_18-1154002.pdf; Component Type: Capacitor 0603; Device Package: 0603; Last Updated: 08.10.2021 08:31:49; Mounting Type: SMD; Operating Temperature: -55 - 125°C; Series: CC; Supplier 1: Mouser; Supplier Part Number 1: 603-CC603KRX7R7BB123; Type: Capacitor; Value: 12 nF; Live Cycle Status: 1; Stock number: not stored
L1 = 742792040: Inductance, 0805, 100 MHz, 600 Ohm, 2 A; Manufacturer: Wurth Elektronik; Type: Inductance SMD; DC current: 2 A; Value: 600 Ohm; Created from: MGremer; Manufacturer Part Number: 742792040; PartID: 1; Created On: 18.01.2021 14:53:17; ComponentLink1Description: Datasheet; ComponentLink1URL: https://www.mouser.de/datasheet/2/445/742792040-1720361.pdf; Component Type: Inductance; Device Package: 0805; Last Updated: 18.01.2021 14:53:25; Mounting Type: SMD; Operating Temperature: -55 - 125 °C; Series: WE-CBF; Supplier 1: Mouser; Supplier Part Number 1: 710-742792040; Live Cycle Status: 1; Stock number: not stored
R12 R13 = RC0603FR-1324R9L: SMD resistor 1%; Manufacturer: Yageo; Created from: MGremer; Manufacturer Part Number: RC0603FR-1324R9L; PartID: 164; Created On: 14.12.2020 16:17:14; ComponentLink1Description: Datasheet; ComponentLink1URL: https://www.mouser.de/datasheet/2/447/PYu-RC_Group_51_RoHS_L_10-1664068.pdf; Component Type: SMD resistor; Device Package: 0603; Last Updated: 02.03.2021 14:07:32; Mounting Type: SMD; Supplier 1: Mouser; Supplier Part Number 1: 603-RC0603FR-1324R9L; Type: Resistor; Tolerance: 1%; Value: 24R9; Live Cycle Status: 1; Stock number: not stored
R14 = RC0603JR-070RL: as R3 on sheet CarrierConnector; Manufacturer Part Number: RC0603JR-070RL; PartID: 1; Created On: 14.12.2020 16:17:14; ComponentLink1Description: Datasheet; ComponentLink1URL: https://www.mouser.de/datasheet/2/447/PYu-RC_Group_51_RoHS_L_10-1664068.pdf; Component Type: SMD resistor; Device Package: 0603; Last Updated: 04.03.2021 09:09:42; Mounting Type: SMD; Supplier 1: Mouser; Supplier Part Number 1: 603-RC0603JR-070RL; Supplier 2: LCSC; Supplier Part Number 2: C21189; Type: Resistor; Value: 0R; Live Cycle Status: 1; Stock number: Labor SMD Container; LCSC Part Number: C21189
TP13 TP14 = -: as TP1 on sheet CarrierConnector; Created: 2018_06_25_AGeiger; Manufacturer Part Number: -; PartID: 9; Created On: 02.03.2021 14:59:37; ComponentLink1Description: Datasheet; ComponentLink1URL: -; ComponentLink2Description: Homepage; ComponentLink2URL: -; Component Type: Test Point; Device Package: SMD; Last Updated: 08.10.2021 21:16:06; Manufacturer: -; Minimum Order: 1; Mounting Type: SMD; Supplier 1: -; Supplier Part Number 1: -; Type: Test point; Live Cycle Status: 1; Stock number: not stored
U4 = LTC2311CMSE-16#PBF: Differential Input ADC with Wide Input Common Mode Range; Manufacturer: Analog Devices; Channels: 1; Resolution: 16 bit; Value: Differential ADC; Created from: MGremer; Manufacturer Part Number: LTC2311CMSE-16#PBF; PartID: 1; Created On: 15.01.2021 12:16:53; ComponentLink1Description: Datasheet; ComponentLink1URL: https://www.mouser.de/datasheet/2/609/231116fa-1271771.pdf; Component Type: ADC; Device Package: MSOP-16; Last Updated: 19.02.2021 13:47:16; Mounting Type: SMD; Operating Temperature: -40 - 125 °C; Supplier 1: Mouser; Supplier Part Number 1: 584-C2311CMSE-16PBF; Type: ADC; Live Cycle Status: 1; Stock number: not stored

## Sheet Power_2.SchDoc
size A4; CompanyName: TH Nürnberg; Organization: UltraZohm; Address1: Kesslerplatz 12; Address2: 90489 Nürnberg; Address3: GERMANY; SheetNumber: 6; SheetTotal: 10
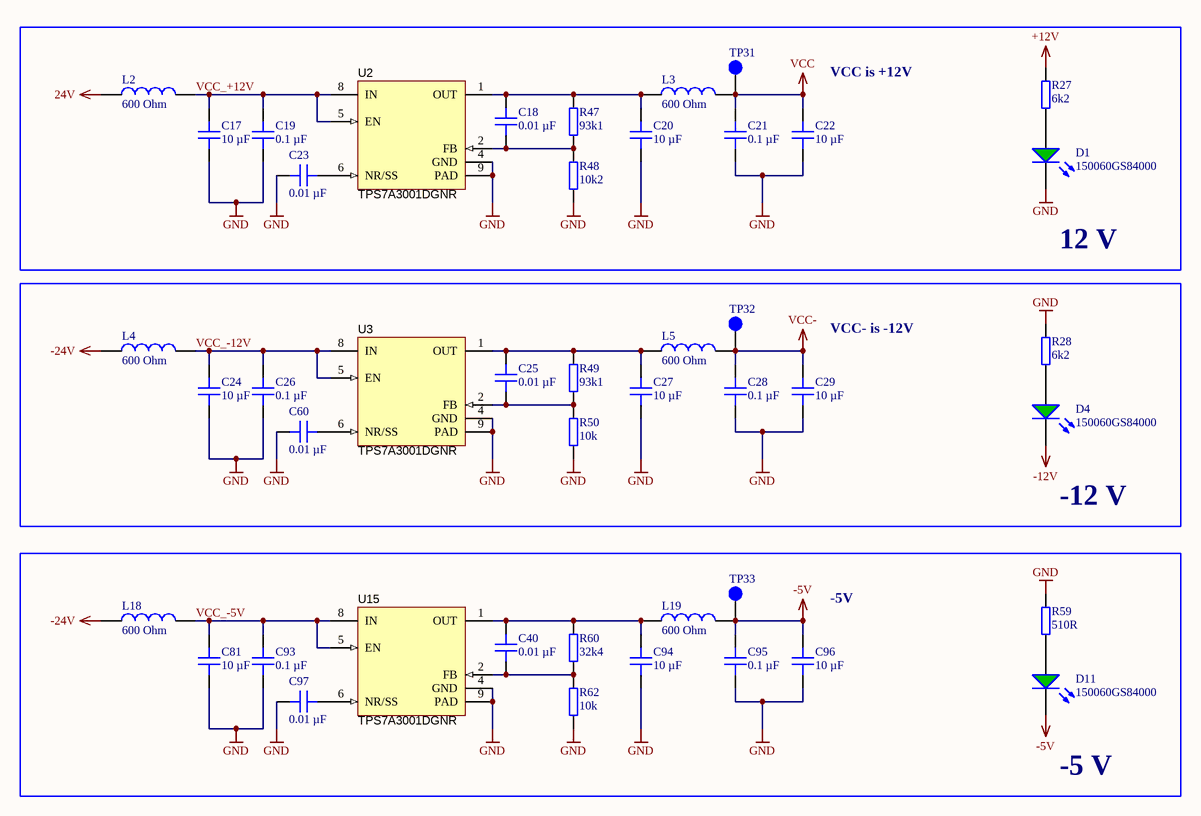
[diagram p4: Power_2.SchDoc]

### Parts
(Parts that share a designator on the sheet are numbered #1, #2 ... from top to bottom, then left to right.)
C17  10 µF  [C_1206]
C18  0.01 µF  [C_0603]
C19  0.1 µF  [C_0603]
C20  10 µF  [C_1206]
C21  0.1 µF  [C_0603]
C22  10 µF  [C_1206]
C23  0.01 µF  [C_0603]
C24  10 µF  [C_1206]
C25  0.01 µF  [C_0603]
C26  0.1 µF  [C_0603]
C27  10 µF  [C_1206]
C28  0.1 µF  [C_0603]
C29  10 µF  [C_1206]
C40  0.01 µF  [C_0603]
C60  0.01 µF  [C_0603]
C81  10 µF  [C_1206]
C93  0.1 µF  [C_0603]
C94  10 µF  [C_1206]
C95  0.1 µF  [C_0603]
C96  10 µF  [C_1206]
C97  0.01 µF  [C_0603]
D1  150060GS84000  [WL-SMCW_0603]
D4  150060GS84000  [WL-SMCW_0603]
D11  150060GS84000  [WL-SMCW_0603]
L2  600 Ohm  [WE-CBF_0805_High Current]
L3  600 Ohm  [WE-CBF_0805_High Current]
L4  600 Ohm  [WE-CBF_0805_High Current]
L5  600 Ohm  [WE-CBF_0805_High Current]
L18  600 Ohm  [WE-CBF_0805_High Current]
L19  600 Ohm  [WE-CBF_0805_High Current]
R27  6k2  [RES 0603_1608]
R28  6k2  [RES 0603_1608]
R47  93k1  [RES 0603_1608]
R48  10k2  [RES 0603_1608]
R49  93k1  [RES 0603_1608]
R50  10k  [RES 0603_1608]
R59  510R  [RES 0603_1608]
R60  32k4  [RES 0603_1608]
R62  10k  [RES 0603_1608]
TP31  -  [TP_1mm]  (value not drawn)
TP32  -  [TP_1mm]  (value not drawn)
TP33  -  [TP_1mm]  (value not drawn)
U2  TPS7A3001DGNR  [DGN0008D_N]
U3#1  TPS7A3001DGNR  [DGN0008D_N]
U15  TPS7A3001DGNR  [DGN0008D_N]

### Blocks framed on the sheet
12 V: C17-C23 D1 L2 L3 R27 R47 R48 TP31 U2
-12 V: C24-C29 C60 D4 L4 L5 R28 R49 R50 TP32 U3#1
-5 V: C40 C81 C93-C97 D11 L18 L19 R59 R60 R62 TP33 U15

### Nets
24V: L2.1
+12V: R27.2
-5V: C95.2 C96.2 D11.1(K) L19.2 TP33.1
-12V: D4.1(K)
-24V: L4.1 L18.1
GND: C17.1 C19.1 C20.1 C21.1 C22.1 C23.1 C24.1 C26.1 C27.1 C28.1 C29.1 C60.2 C81.1 C93.1 C94.1 C95.1 C96.1 C97.2 D1.1(K) R28.2 R48.1 R50.1 R59.2 R62.1 U2.4(GND) U2.9(PAD) U3#1.4(GND) U3#1.9(PAD) U15.4(GND) U15.9(PAD)
VCC: C21.2 C22.2 L3.2 TP31.1
VCC-: C28.2 C29.2 L5.2 TP32.1
VCC_+12V: C17.2 C19.2 L2.2 U2.5(EN) U2.8(IN)
VCC_-5V: C81.2 C93.2 L18.2 U15.5(EN) U15.8(IN)
VCC_-12V: C24.2 C26.2 L4.2 U3#1.5(EN) U3#1.8(IN)
NetC18_1: C18.1 R47.1 R48.2 U2.2(FB)
NetC18_2: C18.2 C20.2 L3.1 R47.2 U2.1(OUT)
NetC23_2: C23.2 U2.6(NR/SS)
NetC25_1: C25.1 R49.1 R50.2 U3#1.2(FB)
NetC25_2: C25.2 C27.2 L5.1 R49.2 U3#1.1(OUT)
NetC40_1: C40.1 R60.1 R62.2 U15.2(FB)
NetC40_2: C40.2 C94.2 L19.1 R60.2 U15.1(OUT)
NetC60_1: C60.1 U3#1.6(NR/SS)
NetC97_1: C97.1 U15.6(NR/SS)
NetD1_2: D1.2(A) R27.1
NetD4_2: D4.2(A) R28.1
NetD11_2: D11.2(A) R59.1

Not connected (* = marked no-connect by the designer): U2 3(NC) 7(DNC); U3#1 3(NC) 7(DNC); U15 3(NC) 7(DNC)

### Notes on the sheet
- (near C22) VCC is +12V
- (near C29) VCC- is -12V
- (near C96) -5V
- Title
- Revision:
- Design Engineer:
- Date:
- Project:
- Sheet
- of

### Library data of the parts
C17 C20 C22 C24 C27 C29 C81 C94 C96 = CGA5L1X7R1H106K160AC: Capacitor 1206, 50 VDC, 10 µF, X7R; Manufacturer: TDK; Tolerance: 10 %; Voltage Rating: 50 VDC; Created from: MGremer; Manufacturer Part Number: CGA5L1X7R1H106K160AC; PartID: 25; Created On: 20.12.2020 13:54:13; ComponentLink1Description: Datasheet; ComponentLink1URL: https://product.tdk.com/info/en/catalog/datasheets/mlcc_automotive_general_en.pdf; Component Type: Capacitor 1206; Device Package: 1206; Last Updated: 20.12.2020 16:34:30; Mounting Type: SMD; Operating Temperature: -55 - 125°C; Series: CGA; Supplier 1: Mouser; Supplier Part Number 1: 810-CGA5L1X7R1H106K1; Type: Capacitor; Value: 10 µF; Live Cycle Status: 1; Stock number: Labor SMD Container
C18 C23 C25 C40 C60 C97 = GCJ188R71H103KA01D: as C83 on sheet OpAmp; Manufacturer Part Number: GCJ188R71H103KA01D; PartID: 1; Created On: 20.12.2020 13:54:13; ComponentLink1Description: Datasheet; ComponentLink1URL: https://www.mouser.de/datasheet/2/281/c03e-516224.pdf; Component Type: Capacitor 0603; Device Package: 0603; Last Updated: 20.12.2020 16:24:16; Mounting Type: SMD; Operating Temperature: -55 - 125°C; Series: GCJ; Supplier 1: Mouser; Supplier Part Number 1: 81-GCJ188R71H103KA1D; Type: Capacitor; Value: 0.01 µF; Live Cycle Status: 1; Stock number: Labor SMD Container
C19 C21 C26 C28 C93 C95 = C0603X104K5RAC7411: as C1 on sheet CarrierConnector; Manufacturer Part Number: C0603X104K5RAC7411; PartID: 3; Created On: 20.12.2020 13:54:13; ComponentLink1Description: Datasheet; ComponentLink1URL: https://www.mouser.de/datasheet/2/212/1/KEM_C1013_X7R_FT_CAP_SMD-1103280.pdf; Component Type: Capacitor 0603; Device Package: 0603; Last Updated: 04.03.2021 09:24:28; Mounting Type: SMD; Operating Temperature: -55 - 125°C; Series: SMD Comm X7R Flex; Supplier 1: Mouser; Supplier Part Number 1: 80-C0603X104K5R7411; Supplier 2: LCSC; Supplier Part Number 2: C14663; Type: Capacitor; Value: 0.1 µF; Live Cycle Status: 1; LCSC Part Number: C14663; Stock number: Labor SMD Container
D1 D4 D11 = 150060GS84000: WL-SMCW SMD Mono-color Chip LED Waterclear Green; Manufacturer: Wuerth Elektronik; Type: Standard; Created from: MGremer; Forward Current I_f: 20 mA; Forward Voltage U_f: 3.2 V; Wavelength: 525 nm; Light Intensity: 3000 mcd; Nominal Power: 78 mW; Manufacturer Part Number: 150060GS84000; PartID: 2; Created On: 08.12.2020 10:41:11; ComponentLink1Description: Datasheet; ComponentLink1URL: https://www.mouser.de/datasheet/2/445/150060GS75020-1714345.pdf; Component Type: LED Diode; Device Package: 0603; Last Updated: 03.03.2021 09:59:51; Mounting Type: SMD; Operating Temperature: -40 - 85 °C; Supplier 1: Mouser; Supplier Part Number 1: 710-150060GS84000; Supplier 2: Farnell; Supplier Part Number 2: 3408612; Supplier 3: Digi-Key; Supplier Part Number 3: 732-150060GS84000CT-ND; Live Cycle Status: 1; Stock number: not stored; Color: green
L2-L5 L18 L19 = 742792040: Inductance, 0805, 100 MHz, 600 Ohm, 2 A; Manufacturer: Wurth Elektronik; Type: Inductance SMD; DC current: 2 A; Created from: MGremer; Manufacturer Part Number: 742792040; PartID: 1; Created On: 18.01.2021 14:53:17; ComponentLink1Description: Datasheet; ComponentLink1URL: https://www.mouser.de/datasheet/2/445/742792040-1720361.pdf; Component Type: Inductance; Device Package: 0805; Last Updated: 18.01.2021 14:53:25; Mounting Type: SMD; Operating Temperature: -55 - 125 °C; Series: WE-CBF; Supplier 1: Mouser; Supplier Part Number 1: 710-742792040; Value: 600 Ohm; Live Cycle Status: 1; Stock number: not stored
R27 R28 = RK73B1JTTD622J: SMD resistor E24 series; Manufacturer: KOA Speer; Tolerance: 5%; Created from: MGremer; Manufacturer Part Number: RK73B1JTTD622J; PartID: 93; Created On: 14.12.2020 16:17:14; ComponentLink1Description: Datasheet; ComponentLink1URL: https://www.mouser.de/datasheet/2/219/RK73B-1825463.pdf; Component Type: SMD resistor; Device Package: 0603; Last Updated: 02.03.2021 14:07:32; Mounting Type: SMD; Supplier 1: Mouser; Supplier Part Number 1: 660-RK73B1JTTD622J; Type: Resistor; Value: 6k2; Live Cycle Status: 1; Stock number: Labor SMD Container
R47 R49 = ERJ-P03F9312V: SMD resistor 1%; Manufacturer: Panasonic; Created from: MGremer; Manufacturer Part Number: ERJ-P03F9312V; PartID: 197; Created On: 14.12.2020 16:17:14; ComponentLink1Description: Datasheet; ComponentLink1URL: https://www.mouser.de/datasheet/2/315/AOA0000C331-1141874.pdf; Component Type: SMD resistor; Device Package: 0603; Last Updated: 02.07.2021 11:49:34; Mounting Type: SMD; Supplier 1: Mouser; Supplier Part Number 1: 667-ERJ-P03F9312V; Type: Resistor; Tolerance: 1%; Value: 93k1; Live Cycle Status: 1; Stock number: not stored
R48 = ERJ-3EKF1022V: SMD resistor 1%; Manufacturer: Panasonic; Created from: MGremer; Manufacturer Part Number: ERJ-3EKF1022V; PartID: 193; Created On: 14.12.2020 16:17:14; ComponentLink1Description: Datasheet; ComponentLink1URL: https://www.mouser.de/datasheet/2/315/AOA0000C304-1149620.pdf; Component Type: SMD resistor; Device Package: 0603; Last Updated: 02.07.2021 11:49:34; Mounting Type: SMD; Supplier 1: Mouser; Supplier Part Number 1: 667-ERJ-3EKF1022V; Type: Resistor; Tolerance: 1%; Value: 10k2; Live Cycle Status: 1; Stock number: not stored
R50 R62 = MCWR06X1002FTL: SMD resistor 1%; Manufacturer: Multicomp PRO; Created from: MGremer; Manufacturer Part Number: MCWR06X1002FTL; PartID: 176; Created On: 14.12.2020 16:17:14; ComponentLink1Description: Datasheet; ComponentLink1URL: http://www.farnell.com/datasheets/2860681.pdf; Component Type: SMD resistor; Device Package: 0603; Last Updated: 02.03.2021 14:07:32; Mounting Type: SMD; Supplier 1: Farnell; Supplier Part Number 1: 2447230; Type: Resistor; Tolerance: 1%; Value: 10k; Live Cycle Status: 1; Stock number: not stored
R59 = RK73B1JTTD511J: SMD resistor E24 series; Manufacturer: KOA Speer; Tolerance: 5%; Created from: MGremer; Manufacturer Part Number: RK73B1JTTD511J; PartID: 67; Created On: 14.12.2020 16:17:14; ComponentLink1Description: Datasheet; ComponentLink1URL: https://www.mouser.de/datasheet/2/219/RK73B-1825463.pdf; Component Type: SMD resistor; Device Package: 0603; Last Updated: 02.03.2021 14:07:32; Mounting Type: SMD; Supplier 1: Mouser; Supplier Part Number 1: 660-RK73B1JTTD511J; Type: Resistor; Value: 510R; Live Cycle Status: 1; Stock number: Labor SMD Container
R60 = ERJ-3EKF3242V: SMD resistor 1%; Manufacturer: Panasonic; Created from: MGremer; Manufacturer Part Number: ERJ-3EKF3242V; PartID: 198; Created On: 14.12.2020 16:17:14; ComponentLink1Description: Datasheet; ComponentLink1URL: https://www.mouser.de/datasheet/2/315/AOA0000C304-1149620.pdf; Component Type: SMD resistor; Device Package: 0603; Last Updated: 02.07.2021 11:49:34; Mounting Type: SMD; Supplier 1: Mouser; Supplier Part Number 1: 667-ERJ-3EKF3242V; Type: Resistor; Tolerance: 1%; Value: 32k4; Live Cycle Status: 1; Stock number: not stored
TP31-TP33 = -: as TP1 on sheet CarrierConnector; Created: 2018_06_25_AGeiger; Manufacturer Part Number: -; PartID: 9; Created On: 02.03.2021 14:59:37; ComponentLink1Description: Datasheet; ComponentLink1URL: -; ComponentLink2Description: Homepage; ComponentLink2URL: -; Component Type: Test Point; Device Package: SMD; Last Updated: 08.10.2021 21:16:06; Manufacturer: -; Minimum Order: 1; Mounting Type: SMD; Supplier 1: -; Supplier Part Number 1: -; Type: Test point; Live Cycle Status: 1; Stock number: not stored
U2 U3#1 U15 = TPS7A3001DGNR: -35 V, -200 mA, ultralow-noise, negative linear regulator; MF: Texas Instruments; Parameter 1: Farnell; Value: -1.18 V - -33 V; Created from: MGremer; PackageReference: DGN0008D; PackageDescription: 8-pin Plastic Small Outline, Body 3 x 3 mm, Pitch 0.65 mm; Supplier 1: Mouser; Supplier Part Number 1: 595-TPS7A3001DGNR; MPN: TPS7A3001DGN; ComponentLink1Description: Datasheet; ComponentLink1URL: https://www.ti.com/general/docs/suppproductinfo.tsp?distId=26&gotoUrl=http%3A%2F%2Fwww.ti.com%2Flit%2Fgpn%2Ftps7a30; ComponentLink2Description: Datasheet; ComponentLink2URL: http://www.ti.com/general/docs/lit/getliterature.tsp?genericPartNumber=TPS7A3001&fileType=pdf; ComponentLink3Description: Package Specification; ComponentLink3URL: http://www.ti.com/litv/pdf/mpds046e; Supplier 2: Mouser; Supplier Part Number 2: 595-TPS7A3001DGNT; Supplier Part Number 3: 3122632; Manufacturer Part Number: TPS7A3001DGNR; PartID: 5; Created On: 24.08.2021 11:34:06; Component Type: LDO; Device Package: SMD; Last Updated: 24.08.2021 11:44:26; Manufacturer: Texas Instruments; Mounting Type: SMD; Operating Temperature: -40 - 125 °C; Series: TPS7A3001; Type: LDO; Live Cycle Status: 1; Stock number: not stored